# Altium project test.PrjPCB
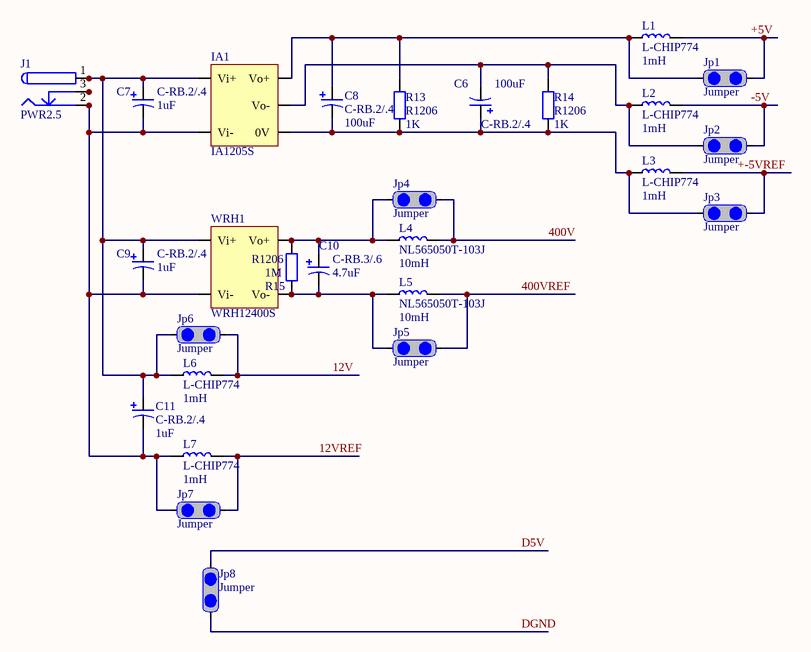
[diagram p0: Power.SchDoc]
3 sheets, 86 parts. Net scope: global (net labels, ports and power ports of the same name join across sheets).
Board file: test.PcbDoc
Sheets:
  Power.SchDoc
  amplify.SchDoc
  triger.SchDoc

## Sheet Power.SchDoc
size A4

### Parts
C6  C-RB.2/.4  value 100uF  [RB.2/.4]
C7  C-RB.2/.4  value 1uF  [RB.2/.4]
C8  C-RB.2/.4  value 100uF  [RB.2/.4]
C9  C-RB.2/.4  value 1uF  [RB.2/.4]
C10  C-RB.3/.6  value 4.7uF  [RB.3/.6]
C11  C-RB.2/.4  value 1uF  [RB.2/.4]
IA1  IA1205S  [IA1205S]
J1  PWR2.5  [KLD-0202]
Jp1  Jumper  [JUMPER]
Jp2  Jumper  [JUMPER]
Jp3  Jumper  [JUMPER]
Jp4  Jumper  [JUMPER]
Jp5  Jumper  [JUMPER]
Jp6  Jumper  [JUMPER]
Jp7  Jumper  [JUMPER]
Jp8  Jumper  [JUMPER]
L1  L-CHIP774  value 1mH  [INDUCTOR070704]
L2  L-CHIP774  value 1mH  [INDUCTOR070704]
L3  L-CHIP774  value 1mH  [INDUCTOR070704]
L4  NL565050T-103J  value 10mH  [NL565050T]
L5  NL565050T-103J  value 10mH  [NL565050T]
L6  L-CHIP774  value 1mH  [INDUCTOR070704]
L7  L-CHIP774  value 1mH  [INDUCTOR070704]
R13  R1206  value 1K  [1206]
R14  R1206  value 1K  [1206]
R15  R1206  value 1M  [1206]
WRH1  WRH12400S  [WRH12400S]

### Nets
12V: Jp6.2(b) L6.2
12VREF: Jp7.2(b) L7.2
400V: Jp4.2(b) L4.2
400VREF: Jp5.2(b) L5.2
+5V: Jp1.2(b) L1.2
+-5VREF: Jp3.2(b) L3.2
-5V: Jp2.2(b) L2.2
D5V: Jp8.2(b)
DGND: Jp8.1(a)
NetC6_1: C6.1(a) IA1.9(Vo-) Jp2.1(a) L2.1 R14.2(b)
NetC6_2: C6.2(b) C8.1(a) IA1.10(0V) Jp3.1(a) L3.1 R13.1(a) R14.1(a)
NetC7_1: C7.1(a) C9.1(a) C11.1(a) IA1.2(Vi-) J1.2 J1.2A J1.2B Jp7.1(a) L7.1 WRH1.2(Vi-)
NetC7_2: C7.2(b) C9.2(b) C11.2(b) IA1.1(Vi+) J1.1 J1.1A J1.1B Jp6.1(a) L6.1 WRH1.1(Vi+)
NetC8_2: C8.2(b) IA1.7(Vo+) Jp1.1(a) L1.1 R13.2(b)
NetC10_1: C10.1(a) Jp5.1(a) L5.1 R15.1(a) WRH1.5(Vo-)
NetC10_2: C10.2(b) Jp4.1(a) L4.1 R15.2(b) WRH1.3(Vo+)
NetJ1_3: J1.3 J1.3A J1.3B

### Library data of the parts
C6-C9 C11 = C-RB.2/.4: Capacitor
C10 = C-RB.3/.6: Capacitor
IA1 = IA1205S: IA1205S,12V to +5V,-5V
J1 = PWR2.5: Low Voltage Power Supply Connector; Published: 17-Dec-2003; DatasheetDocument: 09-May-2002; Publisher: Altium Limited; ComponentLink1Description: Manufacturer Link; ComponentLink1URL: http://domino.kycon.com/internet/Products.html
L1-L3 L6 L7 = Inductor070704: Chip Inductor, 7*7*4
L4 L5 = NL565050T-103J: NL565050T, 10mH, 150 ohm
R13-R15 = R1206: Resistor, 1206, 1/4W
WRH1 = WRH12400S: WRH12400S,12V-400V

## Sheet amplify.SchDoc
size A4
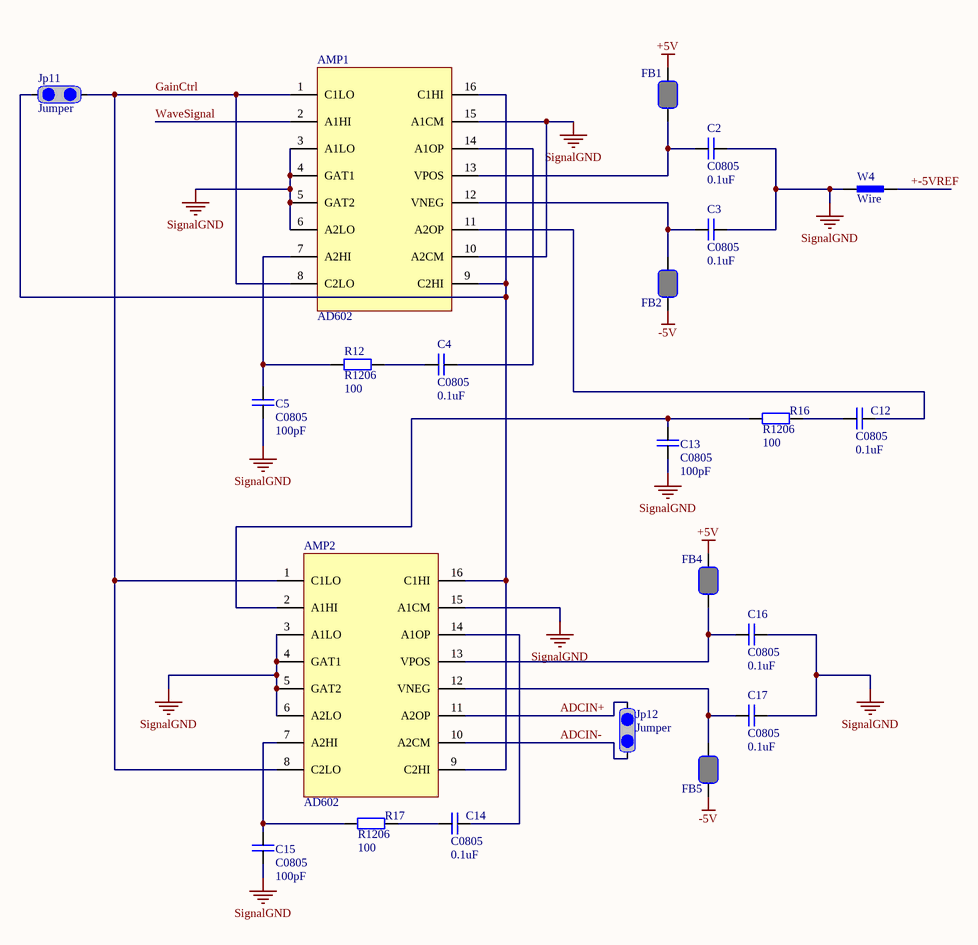
[diagram p1: amplify.SchDoc]

### Parts
AMP1  AD602  [SOP16]
AMP2  AD602  [SOP16]
C2  C0805  value 0.1uF  [0805]
C3  C0805  value 0.1uF  [0805]
C4  C0805  value 0.1uF  [0805]
C5  C0805  value 100pF  [0805]
C12  C0805  value 0.1uF  [0805]
C13  C0805  value 100pF  [0805]
C14  C0805  value 0.1uF  [0805]
C15  C0805  value 100pF  [0805]
C16  C0805  value 0.1uF  [0805]
C17  C0805  value 0.1uF  [0805]
FB1  FB0805  [0805]  (value not drawn)
FB2  FB0805  [0805]  (value not drawn)
FB4  FB0805  [0805]  (value not drawn)
FB5  FB0805  [0805]  (value not drawn)
Jp11  Jumper  [JUMPER]
Jp12  Jumper  [JUMPER]
R12  R1206  value 100  [1206]
R16  R1206  value 100  [1206]
R17  R1206  value 100  [1206]
W4  Wire  [WIRE]

### Nets
+5V: FB1.2(b) FB4.2(b)
+-5VREF: W4.2(b)
-5V: FB2.1(a) FB5.1(a)
SignalGND: AMP1.3(A1LO) AMP1.4(GAT1) AMP1.5(GAT2) AMP1.6(A2LO) AMP1.10(A2CM) AMP1.15(A1CM) AMP2.3(A1LO) AMP2.4(GAT1) AMP2.5(GAT2) AMP2.6(A2LO) AMP2.15(A1CM) C2.2(b) C3.2(b) C5.1(a) C13.1(a) C15.1(a) C16.2(b) C17.2(b) W4.1(a)
ADCIN+: AMP2.11(A2OP) Jp12.2(b)
ADCIN-: AMP2.10(A2CM) Jp12.1(a)
GainCtrl: AMP1.1(C1LO) AMP1.8(C2LO) AMP2.1(C1LO) AMP2.8(C2LO) Jp11.2(b)
WaveSignal: AMP1.2(A1HI)
NetAMP1_7: AMP1.7(A2HI) C5.2(b) R12.1(a)
NetAMP1_9: AMP1.9(C2HI) AMP1.16(C1HI) AMP2.9(C2HI) AMP2.16(C1HI) Jp11.1(a)
NetAMP1_11: AMP1.11(A2OP) C12.2(b)
NetAMP1_12: AMP1.12(VNEG) C3.1(a) FB2.2(b)
NetAMP1_13: AMP1.13(VPOS) C2.1(a) FB1.1(a)
NetAMP1_14: AMP1.14(A1OP) C4.2(b)
NetAMP2_2: AMP2.2(A1HI) C13.2(b) R16.1(a)
NetAMP2_7: AMP2.7(A2HI) C15.2(b) R17.1(a)
NetAMP2_12: AMP2.12(VNEG) C17.1(a) FB5.2(b)
NetAMP2_13: AMP2.13(VPOS) C16.1(a) FB4.1(a)
NetAMP2_14: AMP2.14(A1OP) C14.2(b)
NetC4_1: C4.1(a) R12.2(b)
NetC12_1: C12.1(a) R16.2(b)
NetC14_1: C14.1(a) R17.2(b)

### Library data of the parts
C2-C5 C12-C17 = C0805: Capacitor, 0805
FB1 FB2 FB4 FB5 = FB0805: Chip Bead, 0805
R12 R16 R17 = R1206: Resistor, 1206, 1/4W

## Sheet triger.SchDoc
size A4
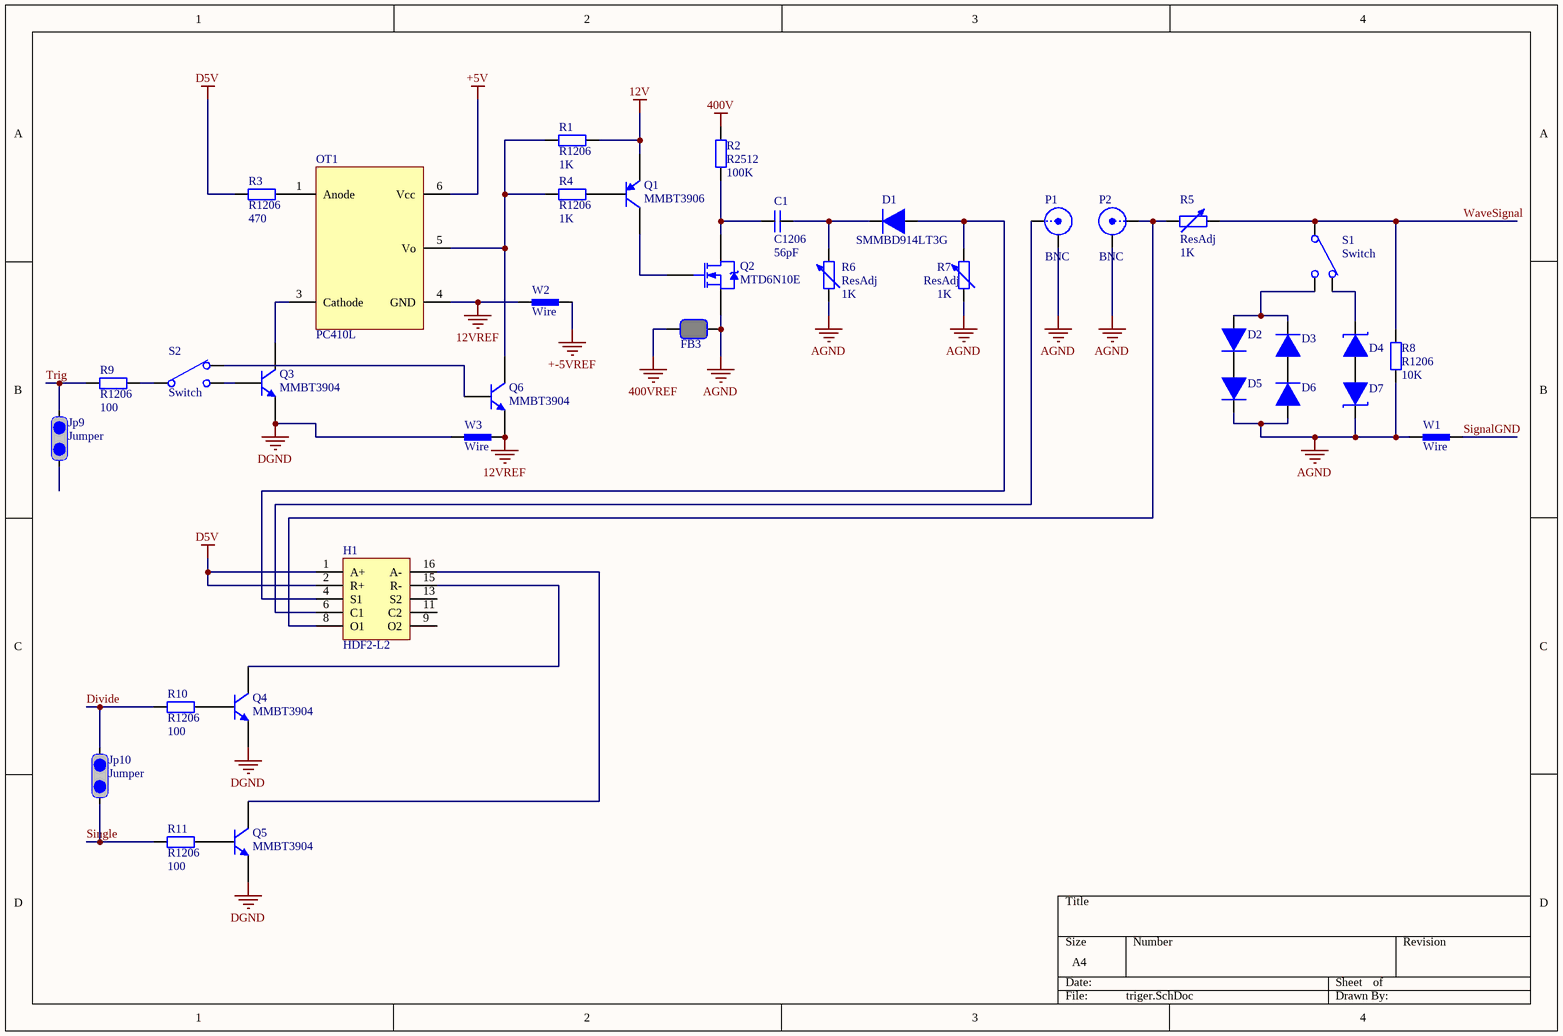
[diagram p2: triger.SchDoc]

### Parts
C1  C1206  value 56pF  [1206]
D1  SMMBD914LT3G  [SMMBD914LT3G]
D2  SMMBD914LT3G  [SMMBD914LT3G]  (value not drawn)
D3  SMMBD914LT3G  [SMMBD914LT3G]  (value not drawn)
D4  ZMM2V4  [DIODE1206]  (value not drawn)
D5  SMMBD914LT3G  [SMMBD914LT3G]  (value not drawn)
D6  SMMBD914LT3G  [SMMBD914LT3G]  (value not drawn)
D7  ZMM2V4  [DIODE1206]  (value not drawn)
FB3  FB0805  [0805]  (value not drawn)
H1  HDF2-L2  [RELAY-HFD2-L2]
Jp9  Jumper  [JUMPER]
Jp10  Jumper  [JUMPER]
OT1  PC410L  [SOP5]
P1  BNC  [BNC_RA CON]
P2  BNC  [BNC_RA CON]
Q1  MMBT3906  [SOT23_M]
Q2  MTD6N10E  [369A-13]
Q3  MMBT3904  [SOT23_M]
Q4  MMBT3904  [SOT23_M]
Q5  MMBT3904  [SOT23_M]
Q6  MMBT3904  [SOT23_M]
R1  R1206  value 1K  [1206]
R2  R2512  value 100K  [2512]
R3  R1206  value 470  [1206]
R4  R1206  value 1K  [1206]
R5  ResAdj  value 1K  [Adjust Resistor]
R6  ResAdj  value 1K  [Adjust Resistor]
R7  ResAdj  value 1K  [Adjust Resistor]
R8  R1206  value 10K  [1206]
R9  R1206  value 100  [1206]
R10  R1206  value 100  [1206]
R11  R1206  value 100  [1206]
S1  Switch  [MSS-22C02]
S2  Switch  [MSS-22C02]
W1  Wire  [WIRE]
W2  Wire  [WIRE]
W3  Wire  [WIRE]

### Nets
12V: Q1.2(E) R1.2(b)
12VREF: OT1.4(GND) Q6.2(E) W2.1(a) W3.2(b)
400V: R2.2(b)
400VREF: FB3.2(b)
+5V: OT1.6(Vcc)
+-5VREF: W2.2(b)
AGND: D5.3(c) D6.1(a) D7.2(b) FB3.1(a) P1.2(Y) P2.2(Y) Q2.3(S) R6.a R7.a R8.1(a) W1.1(a)
D5V: H1.1(A+) H1.2(R+) R3.1(a)
DGND: Q3.2(E) Q4.2(E) Q5.2(E) W3.1(a)
SignalGND: W1.2(b)
Divide: Jp10.2(b) R10.1(a)
Single: Jp10.1(a) R11.1(a)
Trig: Jp9.2(b) R9.1(a)
WaveSignal: R5.b R8.2(b) S1.a
NetC1_1: C1.1(a) Q2.4(D) R2.1(a)
NetC1_2: C1.2(b) D1.3(c) R6.b
NetD1_1: D1.1(a) H1.4(S1) R7.b
NetD2_1: D2.1(a) D3.3(c) S1.c
NetD2_3: D2.3(c) D5.1(a)
NetD3_1: D3.1(a) D6.3(c)
NetD4_1: D4.1(a) D7.1(a)
NetD4_2: D4.2(b) S1.b
NetH1_6: H1.6(C1) P1.1(X)
NetH1_8: H1.8(O1) P2.1(X) R5.a
NetH1_15: H1.15(R-) Q4.3(C)
NetH1_16: H1.16(A-) Q5.3(C)
NetOT1_1: OT1.1(Anode) R3.2(b)
NetOT1_3: OT1.3(Cathode) Q3.3(C)
NetOT1_5: OT1.5(Vo) Q6.3(C) R1.1(a) R4.1(a)
NetQ1_1: Q1.1(B) R4.2(b)
NetQ1_3: Q1.3(C) Q2.1(G)
NetQ3_1: Q3.1(B) S2.c
NetQ4_1: Q4.1(B) R10.2(b)
NetQ5_1: Q5.1(B) R11.2(b)
NetQ6_1: Q6.1(B) S2.b
NetR9_2: R9.2(b) S2.a

Not connected (* = marked no-connect by the designer): H1 9(O2) 11(C2) 13(S2); Jp9 1(a)

### Library data of the parts
C1 = C1206: Capacitor, 1206
D1-D3 D5 D6 = SMMBD914LT3G: Switching Diode
D4 D7 = ZMM2V4: Voltage Stabilizing Diode, 2.4V
FB3 = FB0805: Chip Bead, 0805
H1 = Relay-HDF2-L2: Relay, HDF2-XX-XX-L2-XX
P1 P2 = BNC: BNC Elbow Connector; LatestRevisionDate: 17-Jul-2002; LatestRevisionNote: Re-released for DXP Platform.; Publisher: Altium Limited
Q1 = MMBT3906: PNP Switching Transistor; Published: 17-Sep-2003; LatestRevisionDate: 12-Dec-2006; LatestRevisionNote: IPC-7351 Footprint Added.; DatasheetVersion: 11-Apr-2000; PackageVersion: May-1999; PackageReference: SOT23; Publisher: Altium Limited; PackageDescription: 3-Pin SOT-23 Package 0.95 mm Pitch, 2.3 mm Lead Span; ComponentLink1Description: Manufacturer Link; ComponentLink1URL: http://www.semiconductors.philips.com/; ComponentLink2Description: Datasheet; ComponentLink2URL: http://www.semiconductors.philips.com/acrobat/datasheets/MMBT3906_2.pdf
Q2 = MTD6N10E: TMOS E-FET Power Field Effect Transistor DPAK for Surface Mount; Note: Pin 2 is trimmed and is electrically connected to Pin 4 (Drain); Published: 29-Sep-2000; LatestRevisionDate: 17-Jul-2002; LatestRevisionNote: PCB Footprint, 'SIP-G3/Z11' replaced; Re-released for DXP Platform.; DatasheetVersion: 1995; PackageVersion: 1997; PackageReference: 369A-13; Publisher: Altium Limited; PackageDescription: D-PAK/TO-252-AA; 3 Leads (1 Cropped); Body 10.3 (inc. leads) x 6.7 mm (LxW max); ComponentLink1Description: Manufacturer Link; ComponentLink1URL: http://www.onsemi.com/site/products/landing?taxonomyID=194; ComponentLink2Description: Datasheet; ComponentLink2URL: http://www.onsemi.com/pub/Collateral/MTD6N10E-D.PDF
Q3-Q6 = MMBT3904: NPN Switching Transistor; Published: 17-Sep-2003; LatestRevisionDate: 12-Dec-2006; LatestRevisionNote: IPC-7351 Footprint Added.; DatasheetVersion: 13-May-2002; PackageVersion: May-1999; PackageReference: SOT23; Publisher: Altium Limited; PackageDescription: 3-Pin SOT-23 Package 0.95 mm Pitch, 2.3 mm Lead Span; ComponentLink1Description: Manufacturer Link; ComponentLink1URL: http://www.semiconductors.philips.com/; ComponentLink2Description: Datasheet; ComponentLink2URL: http://www.semiconductors.philips.com/acrobat/datasheets/MMBT3904_4.pdf
R1 R3 R4 R8-R11 = R1206: Resistor, 1206, 1/4W
R2 = R2512: Resistor, 2512, 1W
R5-R7 = ResAdj: Adjustable Resistor
S1 S2 = MSS-22C02: Duble Switch

## Nets that join several sheets
12V: Power (Jp6.2 L6.2), triger (Q1.2 R1.2)
12VREF: Power (Jp7.2 L7.2), triger (OT1.4 Q6.2 W2.1 W3.2)
400V: Power (Jp4.2 L4.2), triger (R2.2)
400VREF: Power (Jp5.2 L5.2), triger (FB3.2)
+5V: Power (Jp1.2 L1.2), amplify (FB1.2 FB4.2), triger (OT1.6)
+-5VREF: Power (Jp3.2 L3.2), amplify (W4.2), triger (W2.2)
-5V: Power (Jp2.2 L2.2), amplify (FB2.1 FB5.1)
D5V: Power (Jp8.2), triger (H1.1 H1.2 R3.1)
DGND: Power (Jp8.1), triger (Q3.2 Q4.2 Q5.2 W3.1)
SignalGND: amplify (19 pins), triger (W1.2)
WaveSignal: amplify (AMP1.2), triger (R5.b R8.2 S1.a)